# Altium project PCB_ROS_CONTROLLER.PrjPcb
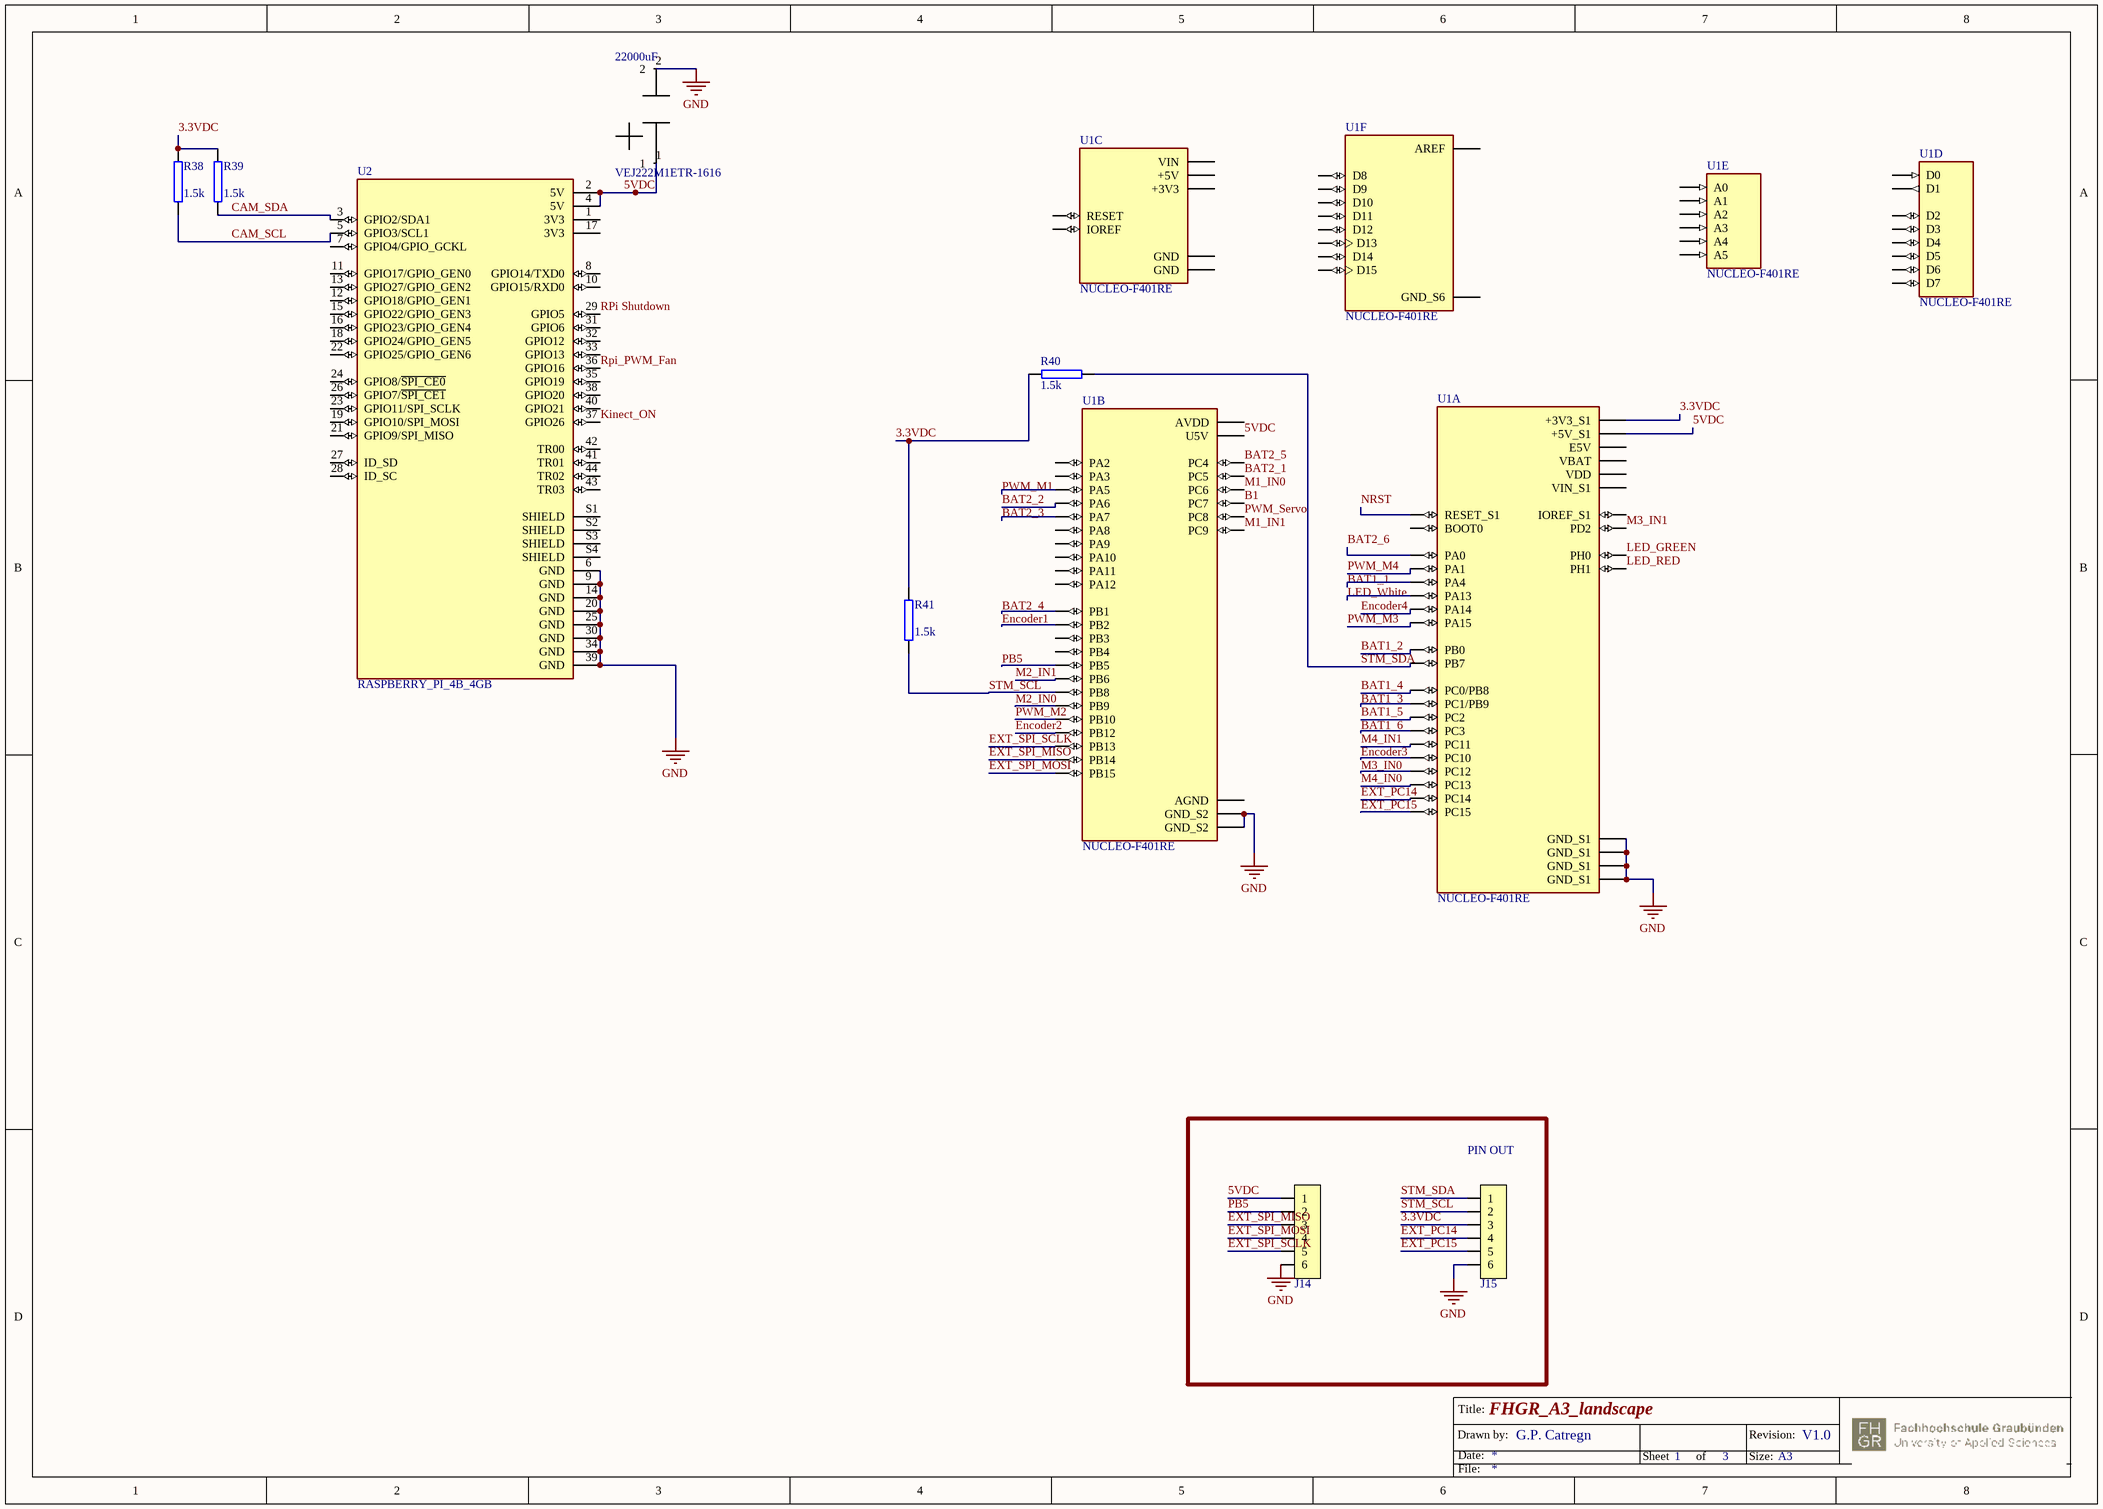
[diagram p0: controllers.SchDoc]
3 sheets, 109 parts. Net scope: global (net labels, ports and power ports of the same name join across sheets).
Board file: PCB2.PcbDoc
Sheets:
  controllers.SchDoc
  INPUT_OUTPUT.SchDoc
  BAT.SchDoc

## Sheet controllers.SchDoc: FHGR_A3_landscape
size A3; Date: 18.07.2017; DrawnBy: G.P. Catregn; Organization: HTW Chur; Address1: Pulvermühlestrasse 57; Address2: 7004 Chur; Address3: Switzerland; DocumentNumber: 1; Revision: V1.0; SheetNumber: 1; SheetTotal: 3; DocumentName: HTW Template

### Parts
22000uF  VEJ222M1ETR-1616  [CAPAE180170X170M]
J14  6Pin_Male  [Header1x6_254]  (value not drawn)
J15  6Pin_Male  [Header1x6_254]  (value not drawn)
R38  value 1.5k  [0805]  (hidden comment: R 1K5 0805)
R39  value 1.5k  [0805]  (hidden comment: R 1K5 0805)
R40  value 1.5k  [0805]  (hidden comment: R 1K5 0805)
R41  value 1.5k  [0805]  (hidden comment: R 1K5 0805)
U1  NUCLEO-F401RE  [ST_NUCLEO-F401RE]  (parts A,B,C,D,E,F of 6)
U2  RASPBERRY_PI_4B_4GB  [MODULE_RASPBERRY_PI_4B_4GB]

### Blocks framed on the sheet
PIN OUT: J14 J15

### Nets
GND: 22000uF.2 J14.6 J15.6 U1.CN7_8(GND_S1) U1.CN7_19(GND_S1) U1.CN7_20(GND_S1) U1.CN7_22(GND_S1) U1.CN10_9(GND_S2) U1.CN10_20(GND_S2) U2.6(GND) U2.9(GND) U2.14(GND) U2.20(GND) U2.25(GND) U2.30(GND) U2.34(GND) U2.39(GND)
3.3VDC: J15.3 R38.2 R39.2 R40.2 R41.2 U1.CN7_16(+3V3_S1)
5VDC: 22000uF.1 J14.1 U1.CN7_18(+5V_S1) U1.CN10_8(U5V) U2.2(5V) U2.4(5V)
B1: U1.CN10_19(PC7)
BAT1_1: U1.CN7_32(PA4)
BAT1_2: U1.CN7_34(PB0)
BAT1_3: U1.CN7_36(PC1/PB9)
BAT1_4: U1.CN7_38(PC0/PB8)
BAT1_5: U1.CN7_35(PC2)
BAT1_6: U1.CN7_37(PC3)
BAT2_1: U1.CN10_6(PC5)
BAT2_2: U1.CN10_13(PA6)
BAT2_3: U1.CN10_15(PA7)
BAT2_4: U1.CN10_24(PB1)
BAT2_5: U1.CN10_34(PC4)
BAT2_6: U1.CN7_28(PA0)
CAM_SCL: R38.1 U2.5(GPIO3/SCL1)
CAM_SDA: R39.1 U2.3(GPIO2/SDA1)
Encoder1: U1.CN10_22(PB2)
Encoder2: U1.CN10_16(PB12)
Encoder3: U1.CN7_1(PC10)
Encoder4: U1.CN7_15(PA14)
EXT_PC14: J15.4 U1.CN7_25(PC14)
EXT_PC15: J15.5 U1.CN7_27(PC15)
EXT_SPI_MISO: J14.3 U1.CN10_28(PB14)
EXT_SPI_MOSI: J14.4 U1.CN10_26(PB15)
EXT_SPI_SCLK: J14.5 U1.CN10_30(PB13)
Kinect_ON: U2.37(GPIO26)
LED_GREEN: U1.CN7_29(PH0)
LED_RED: U1.CN7_31(PH1)
LED_White: U1.CN7_13(PA13)
M1_IN0: U1.CN10_4(PC6)
M1_IN1: U1.CN10_1(PC9)
M2_IN0: U1.CN10_5(PB9)
M2_IN1: U1.CN10_17(PB6)
M3_IN0: U1.CN7_3(PC12)
M3_IN1: U1.CN7_4(PD2)
M4_IN0: U1.CN7_23(PC13)
M4_IN1: U1.CN7_2(PC11)
NRST: U1.CN7_14(RESET_S1)
PB5: J14.2 U1.CN10_29(PB5)
PWM_M1: U1.CN10_11(PA5)
PWM_M2: U1.CN10_25(PB10)
PWM_M3: U1.CN7_17(PA15)
PWM_M4: U1.CN7_30(PA1)
PWM_Servo: U1.CN10_2(PC8)
RPi Shutdown: U2.29(GPIO5)
Rpi_PWM_Fan: U2.36(GPIO16)
STM_SCL: J15.2 R41.1 U1.CN10_3(PB8)
STM_SDA: J15.1 R40.1 U1.CN7_21(PB7)

Not connected (* = marked no-connect by the designer): U1 CN5_1(D8) CN5_2(D9) CN5_3(D10) CN5_4(D11) CN5_5(D12) CN5_6(D13) CN5_7(GND_S6) CN5_8(AREF) CN5_9(D14) CN5_10(D15) CN6_2(IOREF) CN6_3(RESET) CN6_4(+3V3) CN6_5(+5V) CN6_6(GND) CN6_7(GND) CN6_8(VIN) CN7_5(VDD) CN7_6(E5V) CN7_7(BOOT0) CN7_12(IOREF_S1) CN7_24(VIN_S1) CN7_33(VBAT) CN8_1(A0) CN8_2(A1) CN8_3(A2) CN8_4(A3) CN8_5(A4) CN8_6(A5) CN9_1(D0) CN9_2(D1) CN9_3(D2) CN9_4(D3) CN9_5(D4) CN9_6(D5) CN9_7(D6) CN9_8(D7) CN10_7(AVDD) CN10_12(PA12) CN10_14(PA11) CN10_21(PA9) CN10_23(PA8) CN10_27(PB4) CN10_31(PB3) CN10_32(AGND) CN10_33(PA10) CN10_35(PA2) CN10_37(PA3); U2 1(3V3) 7(GPIO4/GPIO_GCKL) 8(GPIO14/TXD0) 10(GPIO15/RXD0) 11(GPIO17/GPIO_GEN0) 12(GPIO18/GPIO_GEN1) 13(GPIO27/GPIO_GEN2) 15(GPIO22/GPIO_GEN3) 16(GPIO23/GPIO_GEN4) 17(3V3) 18(GPIO24/GPIO_GEN5) 19(GPIO10/SPI_MOSI) 21(GPIO9/SPI_MISO) 22(GPIO25/GPIO_GEN6) 23(GPIO11/SPI_SCLK) 24(GPIO8/~{SPI_CE0}) 26(GPIO7/~{SPI_CE1}) 27(ID_SD) 28(ID_SC) 31(GPIO6) 32(GPIO12) 33(GPIO13) 35(GPIO19) 38(GPIO20) 40(GPIO21) 41(TR01) 42(TR00) 43(TR03) 44(TR02) S1(SHIELD) S2(SHIELD) S3(SHIELD) S4(SHIELD)

### Notes on the sheet
- Drawn by:
- Title:
- Date:
- Sheet
- of
- Size:
- Revision:
- A3
- File:

### Library data of the parts
J14 J15 = ArduinoConnector_6: Part ID: ArduinoConnector_6; Price 1pc (CHF): 0.32; Supplier 1: Digi-Key; ComponentLink1Description: Datasheet; ComponentLink1URL: https://katalog.we-online.de/em/datasheet/6130xx11121.pdf; Supplier Part Number 1: 732-5319-ND
R38-R41 = R_1k5_0805: Tolerance: 1%; Power Dissipation: 250mW; Part ID: R_1k5_0805; Price 10pcs (CHF): 0.072; Supplier 1: Digi-Key; Supplier Part Number 1: RNCP0805FTD1K50CT-ND
U1 = NUCLEO-F401RE: STM32 Nucleo-64 development board with STM32F401RET6 MCU, supports Arduino and ST morpho connectivity; Value: *; MP: NUCLEO-F401RE; Package: None; Availability: Unavailable; Price: None
U2 = CMP-052-000000-1: BCM2711 Raspberry Pi 4 Model B 4GB - ARMÂ® CortexÂ®-A72 MPU Embedded Evaluation Board; MP: RASPBERRY PI 4B/4GB; Design Item ID: RASPBERRY_PI_4B_4GB; Source: RASPBERRY_PI_4B_4GB.SchLib; MF: Raspberry Pi; Check_prices: https://www.snapeda.com/parts/RASPBERRY%20PI%204B/4GB/Raspberry+Pi/view-part/?ref=eda; SnapEDA_Link: https://www.snapeda.com/parts/RASPBERRY%20PI%204B/4GB/Raspberry+Pi/view-part/?ref=snap; Value: *; Purchase-URL: https://pricing.snapeda.com/search/part/RASPBERRY PI 4B/4GB/?ref=eda; Price: None; Availability: In Stock; Package: None; Component Type: Standard; Pin Count: 48

## Sheet INPUT_OUTPUT.SchDoc: FHGR_A3_landscape
size A3; Date: 18.07.2017; DrawnBy: G.P. Catregn; Organization: HTW Chur; Address1: Pulvermühlestrasse 57; Address2: 7004 Chur; Address3: Switzerland; DocumentNumber: 1; Revision: V1.0; SheetNumber: 2; SheetTotal: 3; DocumentName: HTW Template
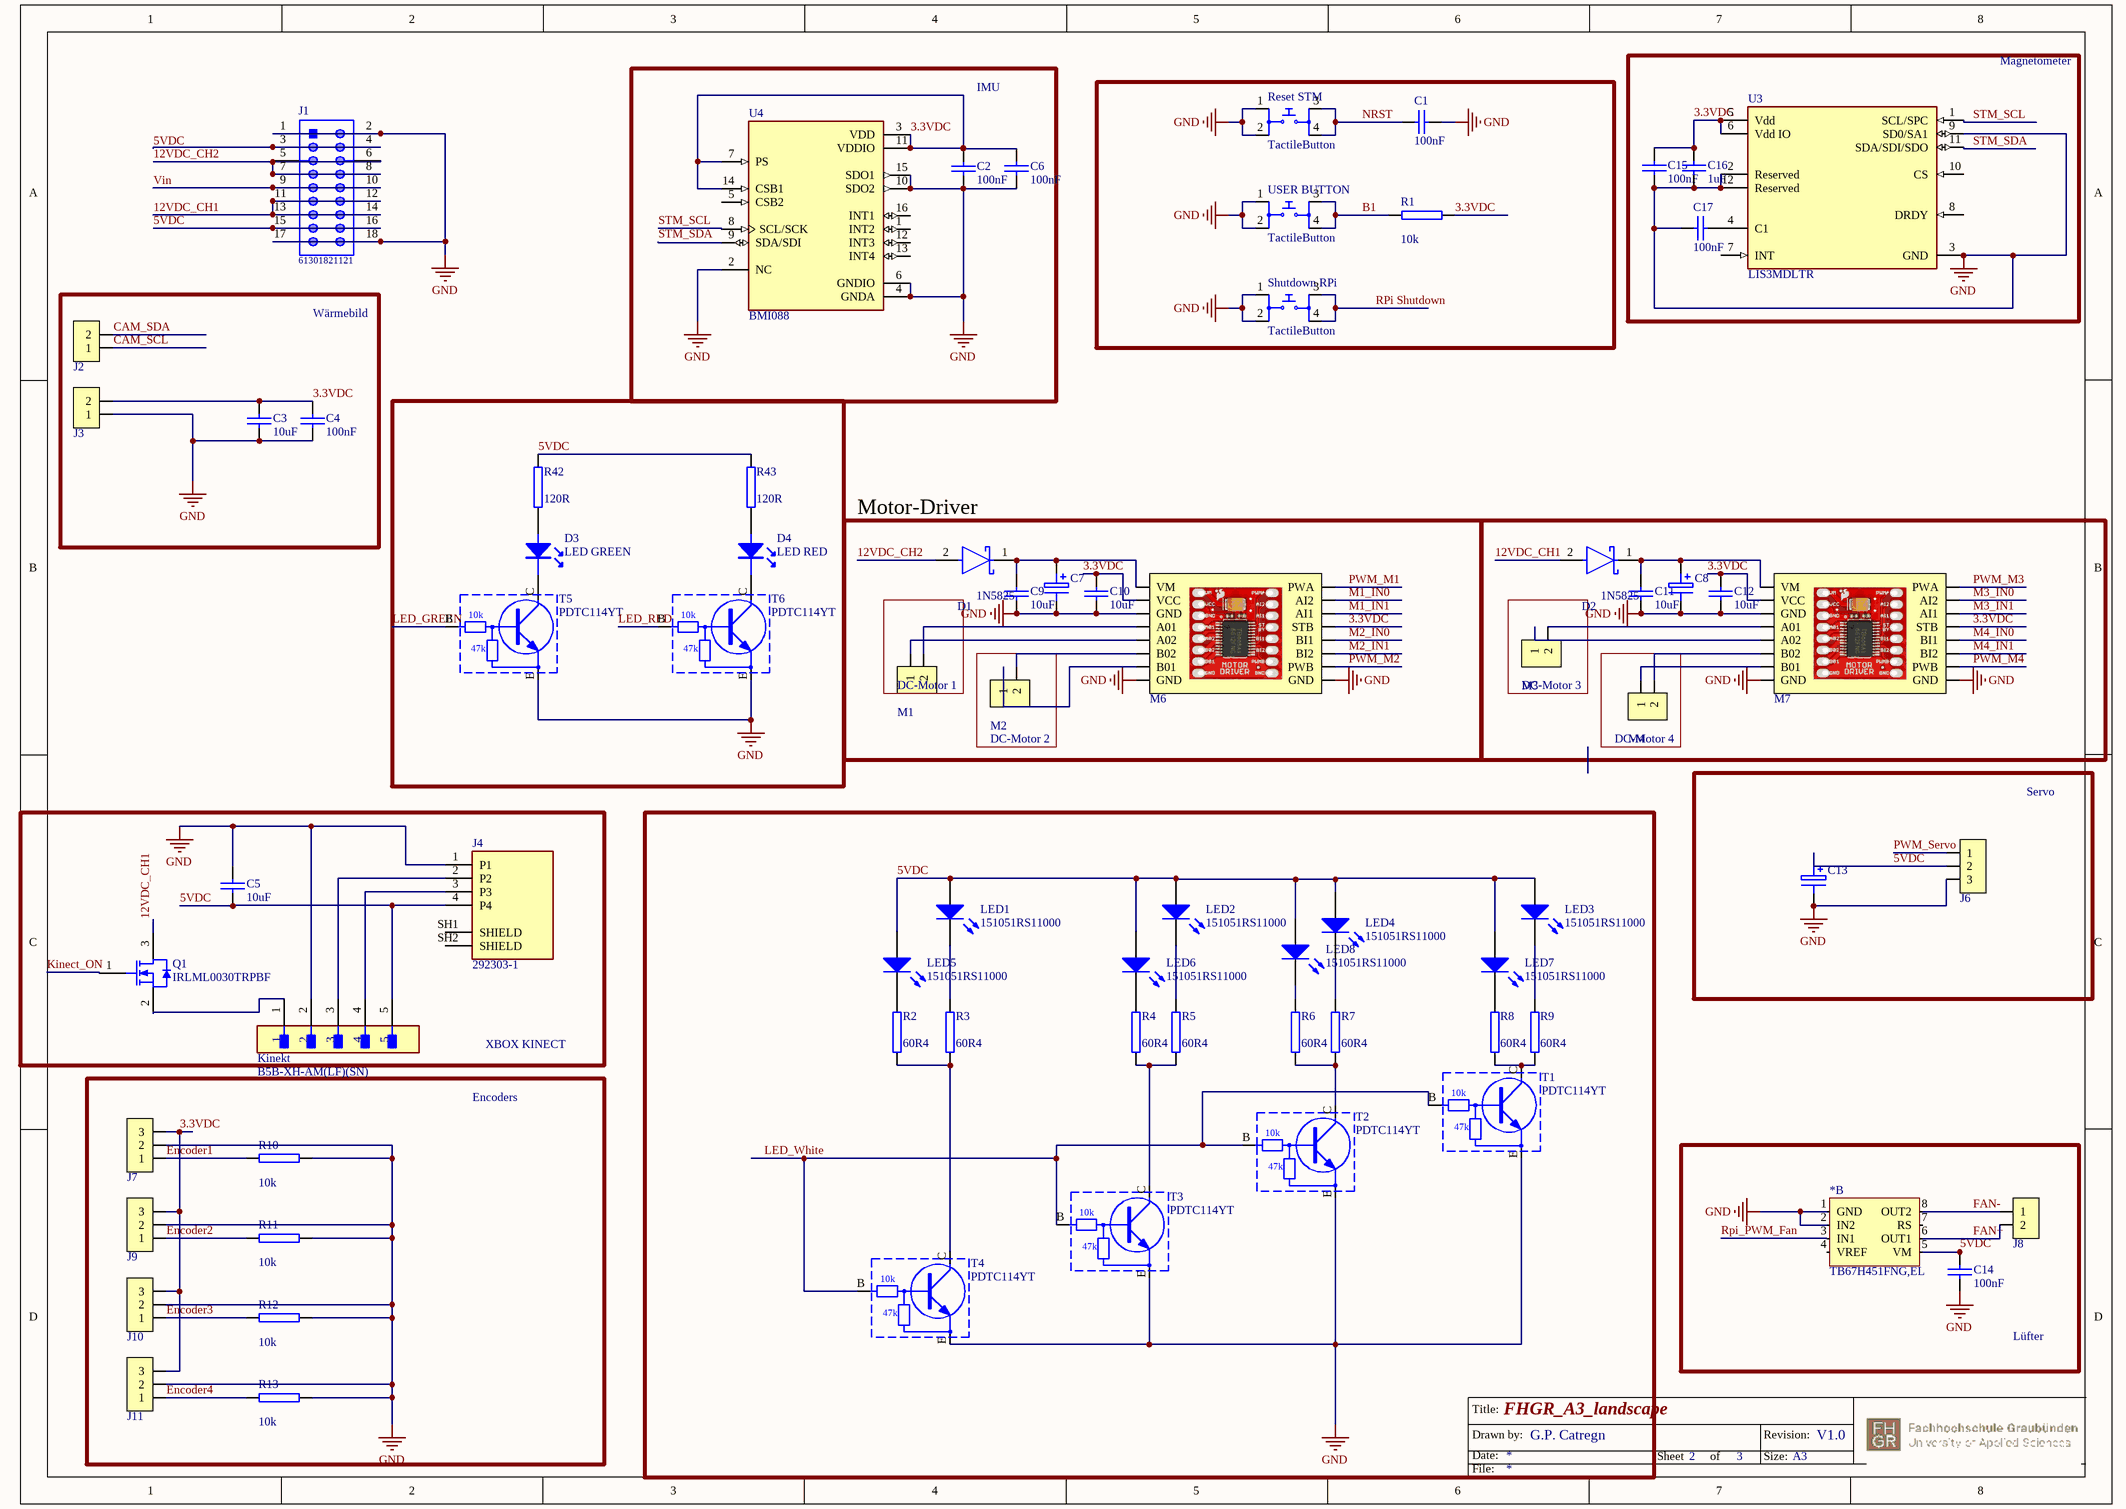
[diagram p1: INPUT_OUTPUT.SchDoc]

### Parts
*  TB67H451FNG,EL  [SOIC127P600X170_HS-9N]  (part B of 2)
C1  value 100nF  [0603]  (hidden comment: C 100nF 0603)
C2  value 100nF  [0603]  (hidden comment: C 100nF 0603)
C3  value 10uF  [0603]  (hidden comment: C 10uF 0603)
C4  value 100nF  [0603]  (hidden comment: C 100nF 0603)
C5  value 10uF  [0603]  (hidden comment: C 10uF 0603)
C6  value 100nF  [0603]  (hidden comment: C 100nF 0603)
C7  C 100uF ALUM  [PCAP_8x10-ELEC00]  (value not drawn)
C8  C 100uF ALUM  [PCAP_8x10-ELEC00]  (value not drawn)
C9  value 10uF  [0603]  (hidden comment: C 10uF 0603)
C10  value 10uF  [0603]  (hidden comment: C 10uF 0603)
C11  value 10uF  [0603]  (hidden comment: C 10uF 0603)
C12  value 10uF  [0603]  (hidden comment: C 10uF 0603)
C13  C 100uF ALUM  [PCAP_8x10-ELEC00]  (value not drawn)
C14  value 100nF  [0603]  (hidden comment: C 100nF 0603)
C15  value 100nF  [0603]  (hidden comment: C 100nF 0603)
C16  value 1uF  [0603]  (hidden comment: C 1uF 0603)
C17  value 100nF  [0603]  (hidden comment: C 100nF 0603)
D1  1N5825  [Microsemi_1N5825_0]  (value not drawn)
D2  1N5825  [Microsemi_1N5825_0]  (value not drawn)
D3  LED GREEN  [LED_1206]
D4  LED RED  [LED_1206]
J1  61301821121  [61301821121]
J2  2Pin_Male  [Header1x2_254]  (value not drawn)
J3  2Pin_Male  [Header1x2_254]  (value not drawn)
J4  292303-1  [TE_292303-1]
J6  3Pin_Male  [Header1x3_254]  (value not drawn)
J7  3Pin_Male  [Header1x3_254]  (value not drawn)
J8  2Pin_Male  [Header1x2_254]  (value not drawn)
J9  3Pin_Male  [Header1x3_254]  (value not drawn)
J10  3Pin_Male  [Header1x3_254]  (value not drawn)
J11  3Pin_Male  [Header1x3_254]  (value not drawn)
Kinekt  B5B-XH-AM(LF)(SN)  [FP-B5B-XH-AM_LF_SN-MFG]
LED1  151051RS11000  [Type 5mm]
LED2  151051RS11000  [Type 5mm]
LED3  151051RS11000  [Type 5mm]
LED4  151051RS11000  [Type 5mm]
LED5  151051RS11000  [Type 5mm]
LED6  151051RS11000  [Type 5mm]
LED7  151051RS11000  [Type 5mm]
LED8  151051RS11000  [Type 5mm]
M1  2Pin_Female  [OSTTE020104]  (value not drawn)
M2  2Pin_Female  [OSTTE020104]  (value not drawn)
M3  2Pin_Female  [OSTTE020104]  (value not drawn)
M4  2Pin_Female  [OSTTE020104]  (value not drawn)
M6  SPARKFUN_ROB_14451  [SPARKFUN_ROB_14451]  (value not drawn)
M7  SPARKFUN_ROB_14451  [SPARKFUN_ROB_14451]  (value not drawn)
Q1  IRLML0030TRPBF  [INTR-SOT-23-3_V]
R1  value 10k  [0805]  (hidden comment: R 10K 0805)
R2  value 60R4  [0805]  (hidden comment: R 60R4 0805)
R3  value 60R4  [0805]  (hidden comment: R 60R4 0805)
R4  value 60R4  [0805]  (hidden comment: R 60R4 0805)
R5  value 60R4  [0805]  (hidden comment: R 60R4 0805)
R6  value 60R4  [0805]  (hidden comment: R 60R4 0805)
R7  value 60R4  [0805]  (hidden comment: R 60R4 0805)
R8  value 60R4  [0805]  (hidden comment: R 60R4 0805)
R9  value 60R4  [0805]  (hidden comment: R 60R4 0805)
R10  value 10k  [0805]  (hidden comment: R 10K 0805)
R11  value 10k  [0805]  (hidden comment: R 10K 0805)
R12  value 10k  [0805]  (hidden comment: R 10K 0805)
R13  value 10k  [0805]  (hidden comment: R 10K 0805)
R42  value 120R  [0805]  (hidden comment: R 120R 0805)
R43  value 120R  [0805]  (hidden comment: R 120R 0805)
Reset_STM  TactileButton  [TactileButton-6x6mm]
Shutdown_RPi  TactileButton  [TactileButton-6x6mm]
T1  PDTC114YT  [SOT-23]
T2  PDTC114YT  [SOT-23]
T3  PDTC114YT  [SOT-23]
T4  PDTC114YT  [SOT-23]
T5  PDTC114YT  [SOT-23]
T6  PDTC114YT  [SOT-23]
U3  LIS3MDLTR  [FP-VFLGA-12-8365767-MFG]
U4  BMI088  [PQFN50P450X300X100-16N]
USER_BUTTON  TactileButton  [TactileButton-6x6mm]

### Blocks framed on the sheet
IMU: C2 C6 U4
Magnetometer: C15-C17 U3
Wärmebild: C3 C4 J2 J3
Motor-Driver: C7 C9 C10 D1 M6
DC-Motor 1: M1
DC-Motor 3: M3
DC-Motor 2: M2
DC-Motor 4: M4
Servo: C13 J6
XBOX KINECT: C5 J4 Kinekt Q1
Encoders: J7 J9-J11 R10-R13
Lüfter: * C14 J8

### Nets
GND: *.1(GND) *.2(IN2) C1.2 C2.2 C3.2 C4.2 C5.1 C6.2 C7.2 C8.2 C9.2 C10.2 C11.2 C12.2 C13.2 C14.2 C15.2 C16.2 C17.1 J1.1 J1.2 J1.17 J1.18 J3.1 J4.1(P1) J6.3 J7.2 J9.2 J10.2 J11.2 Kinekt.2 M6.3(GND) M6.8(GND) M6.9(GND) M7.3(GND) M7.8(GND) M7.9(GND) R10.2 R11.2 R12.1 R13.2 Reset_STM.1 Reset_STM.2 Shutdown_RPi.1 Shutdown_RPi.2 T1.E T2.E T3.E T4.E T5.E T6.E U3.2(Reserved) U3.3(GND) U3.9(SD0/SA1) U3.12(Reserved) U4.2(NC) U4.4(GNDA) U4.6(GNDIO) U4.10(SDO2) U4.15(SDO1) USER_BUTTON.1 USER_BUTTON.2
3.3VDC: C2.1 C3.1 C4.1 C6.1 C10.1 C12.1 C15.1 C16.1 J3.2 J7.3 J9.3 J10.3 J11.3 M6.2(VCC) M6.13(STB) M7.2(VCC) M7.13(STB) R1.2 U3.5(Vdd) U3.6(Vdd_IO) U4.3(VDD) U4.7(PS) U4.11(VDDIO) U4.14(CSB1)
5VDC: *.5(VM) C5.2 C13.1 C14.1 J1.3 J1.4 J1.15 J1.16 J4.4(P4) J6.2 Kinekt.5 LED1.2(A) LED2.2(A) LED3.2(A) LED4.2(A) LED5.2(A) LED6.2(A) LED7.2(A) LED8.2(A) R42.2 R43.2
12VDC_CH1: D2.2(A) J1.11 J1.12 J1.13 J1.14 Q1.3(D)
12VDC_CH2: D1.2(A) J1.5 J1.6 J1.7 J1.8
B1: R1.1 USER_BUTTON.3 USER_BUTTON.4
CAM_SCL: J2.1
CAM_SDA: J2.2
Encoder1: J7.1 R10.1
Encoder2: J9.1 R11.1
Encoder3: J10.1 R12.2
Encoder4: J11.1 R13.1
FAN+: *.6(OUT1) J8.2
FAN-: *.8(OUT2) J8.1
Kinect_ON: Q1.1(G)
LED_GREEN: T5.B
LED_RED: T6.B
LED_White: T1.B T2.B T3.B T4.B
M1_IN0: M6.15(AI2)
M1_IN1: M6.14(AI1)
M2_IN0: M6.12(BI1)
M2_IN1: M6.11(BI2)
M3_IN0: M7.15(AI2)
M3_IN1: M7.14(AI1)
M4_IN0: M7.12(BI1)
M4_IN1: M7.11(BI2)
NRST: C1.1 Reset_STM.3 Reset_STM.4
PWM_M1: M6.16(PWA)
PWM_M2: M6.10(PWB)
PWM_M3: M7.16(PWA)
PWM_M4: M7.10(PWB)
PWM_Servo: J6.1
RPi Shutdown: Shutdown_RPi.3 Shutdown_RPi.4
Rpi_PWM_Fan: *.3(IN1)
STM_SCL: U3.1(SCL/SPC) U4.8(SCL/SCK)
STM_SDA: U3.11(SDA/SDI/SDO) U4.9(SDA/SDI)
Vin: J1.9 J1.10
NetC7_1: C7.1 C9.1 D1.1(C) M6.1(VM)
NetC8_1: C8.1 C11.1 D2.1(C) M7.1(VM)
NetC17_2: C17.2 U3.4(C1)
NetD3_A: D3.A R42.1
NetD3_K: D3.K T5.C
NetD4_A: D4.A R43.1
NetD4_K: D4.K T6.C
NetJ4_2: J4.2(P2) Kinekt.3
NetJ4_3: J4.3(P3) Kinekt.4
NetKinekt_1: Kinekt.1 Q1.2(S)
NetLED1_1: LED1.1(K) R3.2
NetLED2_1: LED2.1(K) R5.2
NetLED3_1: LED3.1(K) R9.2
NetLED4_1: LED4.1(K) R7.2
NetLED5_1: LED5.1(K) R2.2
NetLED6_1: LED6.1(K) R4.2
NetLED7_1: LED7.1(K) R8.2
NetLED8_1: LED8.1(K) R6.2
NetM1_1: M1.1 M6.5(A02)
NetM1_2: M1.2 M6.4(A01)
NetM2_1: M2.1 M6.7(B01)
NetM2_2: M2.2 M6.6(B02)
NetM3_1: M3.1 M7.5(A02)
NetM3_2: M3.2 M7.4(A01)
NetM4_1: M4.1 M7.7(B01)
NetM4_2: M4.2 M7.6(B02)
NetR2_1: R2.1 R3.1 T4.C
NetR4_1: R4.1 R5.1 T3.C
NetR6_1: R6.1 R7.1 T2.C
NetR8_1: R8.1 R9.1 T1.C

Not connected (* = marked no-connect by the designer): * 4(VREF) 7(RS); J4 SH1(SHIELD) SH2(SHIELD); U3 7(INT) 8(DRDY) 10(CS); U4 1(INT2) 5(CSB2) 12(INT3) 13(INT4) 16(INT1)

### Notes on the sheet
- Drawn by:
- Title:
- Date:
- Sheet
- of
- Size:
- Revision:
- A3
- File:
- (in symbol T_PDTC114YT) 10k; 47k

### Library data of the parts
C1 C2 C4 C6 C14 C15 C17 = C_100nF_0603: TempKoeff: Y5V; Tolerance: -20%/+80%; Voltage: 50V; Part ID: C_100nF_0603; Price 1pc (CHF): 0.1; Supplier 1: Digi-Key; Supplier Part Number 1: 1276-1012-1-ND
C3 C5 C9-C12 = C_10uF_0603: TempKoeff: X5R; Tolerance: 10%; Voltage: 16V; Part ID: C_10uF_0603; Price 1pc (CHF): 0.40; Supplier 1: Digi-Key; Supplier Part Number 1: 490-12317-1-ND
C7 C8 C13 = C_100uF_ALUM: Tolerance: 20%; Voltage: 50V; VALUE: 100uF; Part ID: C_100uF_ALUM; Price 1pc (CHF): 0.51; Supplier 1: Digi-Key; Supplier Part Number 1: 493-2226-1-ND
C16 = C_1uF_0603: TempKoeff: X7R; Tolerance: 10%; Voltage: 25V; Part ID: C_1uF_0603; Price 1pc (CHF): 0.29; Supplier 1: Digi-Key; Supplier Part Number 1: 1276-6617-1-ND
D3 = LED_GREEN_1206: Peak Wavelenght: 565nm; Part ID: LED_GREEN_1206; Price 10pcs: 0.226; Supplier 1: Digi-Key; Supplier Part Number 1: 67-1357-1-ND; ComponentLink1Description: Datasheet; ComponentLink1URL: https://media.digikey.com/pdf/Data%20Sheets/Lite-On%20PDFs/LTST-C230KGKT.pdf
D4 = LED_RED_1206: Peak Wavelenght: 639nm; Part ID: LED_RED_1206; Price 10pcs: 0.233; Supplier 1: Digi-Key; Supplier Part Number 1: 160-1457-1-ND; ComponentLink1Description: Datasheet; ComponentLink1URL: https://media.digikey.com/pdf/Data%20Sheets/Lite-On%20PDFs/LTST-C230KRKT.pdf
J1 = CMP-1502-01101-1: THT Vertical Pin Header WR-PHD, Pitch 2.54 mm, Dual Row, 18 pins; Manufacturer: Wurth Elektronik; Withstanding Voltage: 500VAC; Pin Number: 18; Pitch: 2.54mm; Rated Current: 3A; Contact Resistance: 20mOhm; Gender: Male; Working Voltage: 250VAC; Publisher: WurthElektronik; Packaging: Bag; Row Number: Dual; Datasheet URL: https://katalog.we-online.de/em/datasheet/6130xx21121.pdf; Mounting Technology: THT; Orientation: Vertical; Part Number: 61301821121; Package Reference: 61301821121; Manufacturer URL: http://www.we-online.de; Operating Temperature: -40to105degC
J2 J3 J8 = Header_2: Part ID: Header_2; Price 1pc (CHF): 0.13; Supplier 1: Digi-Key; ComponentLink1Description: Datasheet; ComponentLink1URL: https://katalog.we-online.de/em/datasheet/6130xx11121.pdf; Supplier Part Number 1: 732-5315-ND
J4 = 292303-1: CONN USB RECEPT R/A TYPE A 4POS; Value: *; MP: 292303-1; Package: None; Availability: Unavailable; Price: None
J6 J7 J9-J11 = Header_3: Part ID: Header_3; Price 1pc (CHF): 0.12; Supplier 1: Digi-Key; ComponentLink1Description: Datasheet; ComponentLink1URL: https://www.we-online.com/katalog/datasheet/6130xx11121.pdf; Supplier Part Number 1: 732-5316-ND
Kinekt = CMP-17439-000304-1: CONN HEADER VERT 5POS 2.5MM; Mated Stacking Heights: 9.8mm; Voltage Rating: 250V; Max Current Rating: 3A; Number of Positions: 5; Contact Resistance: 20mR; Depth: 5.75mm; Connector Type: Header; Color: Green; Insulation Material: Nylon; Contact Plating: Copper; Length: 14.9mm; Fastening Type: Detent; Contact Material: Brass; Number of Rows: 1; Contact Type: Male Pin; Housing Material: Polyamide; Housing Color: White; Lead Free: Lead Free; Max Voltage Rating (AC): 250V; Mount: Through Hole; Contact Shape: Square; Min Operating Temperature: -25°C; Packaging: Bulk; Orientation: Straight; Insulation Color: Natural; Series: XH; Flammability Rating: UL94 V-0; Contact Finish - Mating: TIN; Max Operating Temperature: 85°C; Termination: Solder; Pitch: 2.5mm
LED1-LED8 = CMP-1488-00008-1: THT LED round mono-color color lens, WL-TMRW, Red; Manufacturer: Wuerth Elektronik; PackageReference: Type 5mm; PartNumber: 151051RS11000; ComponentLink2URL: http://katalog.we-online.de/pbs/datasheet/7448042001.pdfhttp://katalog.we-online.de/pbs/datasheet/7448042001.pdfhttp://katalog.we-online.de/pbs/datasheet/7448042001.pdfhttp://katalog.we-online.de/pbs/datasheet/151051RS11000.pdf; ComponentLink1URL: http://www.we-online.com; ComponentLink1Description: Manufacturer URL; ComponentLink2Description: Datasheet; Emitting color: Red
M1-M4 = Terminal_2Pin: Part ID: Terminal_2Pin; Price 1pc (CHF): 0.69; Supplier 1: Digi-Key; ComponentLink1Description: Datasheet; ComponentLink1URL: https://www.on-shore.com/wp-content/uploads/OSTTEXX0104.pdf; Supplier Part Number 1: ED2740-ND
M6 M7 = SPARKFUN_ROB_14451: Dual Motor Driver; Stecker: 2 x 732-5321-ND; Buchse: 2 x SAM1213-08-ND; Part ID: SPARKFUN_ROB_14451; Price 1pc (CHF): 4.5; Supplier 1: Digi-Key; ComponentLink1Description: Datasheet; ComponentLink1URL: https://media.digikey.com/pdf/Data%20Sheets/Sparkfun%20PDFs/ROB-14451_Web.pdf; Supplier Part Number 1: 1568-1756-ND
Q1 = CMP-2000-06483-1: HEXFET(R) Power MOSFET, 1.3 W, 4.4 ns, -55 to 150 degC, 3-Pin SOT-23, RoHS, Tape and Reel; Manufacturer: International Rectifier; Maximum Drain Source Resistance: 0.027Ω; Transistor Configuration: Single; Channel Mode: Enhancement; Maximum Power Dissipation: 1.3W; Typical Input Capacitance @ Vds: 382pF@15V; Maximum Gate Source Voltage: ±20V; Number of Elements per Chip: 1; Transistor Material: Si; Maximum Gate Threshold Voltage: 2.3V; Typical Turn-On Delay Time: 5.2ns; Maximum Drain Source Voltage: 30V; Typical Turn-Off Delay Time: 7.4ns; Minimum Gate Threshold Voltage: 1.3V; Channel Type: N; Typical Gate Charge @ Vgs: 2.6nC@4.5V; Maximum Continuous Drain Current: 5.3A; Pin Count: 3; Mounting Technology: SurfaceMount; Datasheet URL: https://datasheet.ciiva.com/4442/irlml0030pbf-90019-4442451.pdf; Datasheet Version: 02/2012; Maximum Operating Temperature: +150°C; Category: PowerMOSFET; Package Description: 3-Pin Small Outline Transistor, Body 2.92 x 1.3 mm, Pitch 0.95 mm; Manufacturer URL: http://internationalrectifier.com/; Height: 1.02mm; Minimum Operating Temperature: -55°C; Dimensions: 3.04x1.4x1.02mm; Package Reference: SOT-23-3; Package Type: SOT-23; Mounting Type: SurfaceMount; Length: 3.04mm; Width: 1.4mm
R1 R10-R13 = R_10k_0805: Tolerance: 1%; Power Dissipation: 125mW; Part ID: R_10k_0805; Price 10pcs (CHF): 0.021; Supplier 1: Digi-Key; Supplier Part Number 1: 311-10.0KCRCT-ND
R2-R9 = R_60R4_0805: Tolerance: 1%; Power Dissipation: 125mW; Part ID: R_60R4_0805; Price 10pcs (CHF): 0.042; Supplier 1: Digi-Key; Supplier Part Number 1: 311-60.4CRCT-ND
R42 R43 = R_120R_0805: Tolerance: 1%; Power Dissipation: 125mW; Part ID: R_120R_0805; Price 10pcs (CHF): 0.046; Supplier 1: Digi-Key; Supplier Part Number 1: A129738CT-ND
Reset_STM Shutdown_RPi USER_BUTTON = TactileButton: Voltage: 12V; Current: 50mA; Part ID: TactileButton; Price 1pc (CHF): 0.59; Dimension: 6.2mmx6.2mmx4.3mm; Supplier 1: Digi-Key; ComponentLink1Description: Datasheet; ComponentLink1URL: https://media.digikey.com/pdf/Data%20Sheets/APEM%20Components%20PDFs/ADTS6,%20ADTSM,%20AKTSC6%20Series.pdf; Supplier Part Number 1: 679-2380-1-ND
T1-T6 = T_PDTC114YT: Frequency: 230MHz; Voltage: 50V; Current: 100mA; Power Dissipation: 250mW; Part ID: T_PDTC114YT; Price 1pc (CHF): 0.18; ComponentLink1URL: https://assets.nexperia.com/documents/data-sheet/PDTC114Y_SER.pdf; ComponentLink1Description: Datasheet; Supplier 1: Digi-Key; Supplier Part Number 1: 1727-5134-6-ND
U3 = CMP-2000-07463-2: SENSOR MR I2C/SPI 12LGA; Manufacturer: STMicroelectronics; Sensor Output: I2C,SPI; Operating Supply Current: 40-270uA; Max Supply Voltage: 3.6V; Sensing Method: Magnetic; Min Supply Voltage: 1.71V; ComponentLink2URL: https://www.st.com/resource/en/datasheet/lis3mdl.pdf; Category: IC; Manufacturer Part Number: LIS3MDLTR; Octopart: https://octopart.com/lis3mdltr-stmicroelectronics-29403125; Automotive: No; ComponentLink2Description: Datasheet; RoHS: TRUE; Device Class L3: unset; Device Class L1: Sensors; Temperature: -40°C to +85°C; Height: 1mm; Mouser Description: Board Mount Hall Effect / Magnetic Sensors Ultra Lo-Pwr Hi Perf 3-Axis 1.9-3.6V; Temperature Range High: +85°C; Lead Free: Yes; Device Class L2: Magnetic Sensors; Footprint Url: https://www.st.com/content/ccc/resource/technical/document/technical_note/73/17/9c/16/dd/96/4a/01/CD00134799.pdf/files/CD00134799.pdf/jcr:content/translations/en.CD00134799.pdf; Temperature Range Low: -40°C; Package: VFLGA-12-8365767; Digikey Description: SENSOR MR I2C/SPI 12LGA
U4 = BMI088: High-performance 6-axis inertial sensor (accelerometer + gyroscope) <a href="https://pricing.snapeda.com/parts/BMI088/Bosch%20Sensortec/view-part?ref=eda">Check prices</a>; Package: None; MP: BMI088; Value: *; Availability: Unavailable; Price: None

## Sheet BAT.SchDoc: FHGR_A3_landscape
size A3; Date: 18.07.2017; DrawnBy: G.P. Catregn; Organization: HTW Chur; Address1: Pulvermühlestrasse 57; Address2: 7004 Chur; Address3: Switzerland; DocumentNumber: 1; Revision: V1.0; SheetNumber: 3; SheetTotal: 3; DocumentName: HTW Template
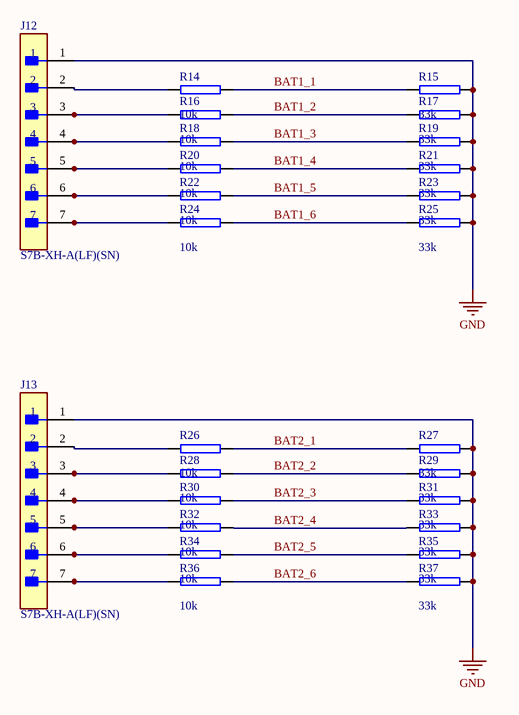
[diagram p2: BAT.SchDoc]

### Parts
J12  S7B-XH-A(LF)(SN)  [FP-S7B-XH-A_LF_SN-MFG]
J13  S7B-XH-A(LF)(SN)  [FP-S7B-XH-A_LF_SN-MFG]
R14  value 10k  [0805]  (hidden comment: R 10K 0805)
R15  value 33k  [0805]  (hidden comment: R 33K 0805)
R16  value 10k  [0805]  (hidden comment: R 10K 0805)
R17  value 33k  [0805]  (hidden comment: R 33K 0805)
R18  value 10k  [0805]  (hidden comment: R 10K 0805)
R19  value 33k  [0805]  (hidden comment: R 33K 0805)
R20  value 10k  [0805]  (hidden comment: R 10K 0805)
R21  value 33k  [0805]  (hidden comment: R 33K 0805)
R22  value 10k  [0805]  (hidden comment: R 10K 0805)
R23  value 33k  [0805]  (hidden comment: R 33K 0805)
R24  value 10k  [0805]  (hidden comment: R 10K 0805)
R25  value 33k  [0805]  (hidden comment: R 33K 0805)
R26  value 10k  [0805]  (hidden comment: R 10K 0805)
R27  value 33k  [0805]  (hidden comment: R 33K 0805)
R28  value 10k  [0805]  (hidden comment: R 10K 0805)
R29  value 33k  [0805]  (hidden comment: R 33K 0805)
R30  value 10k  [0805]  (hidden comment: R 10K 0805)
R31  value 33k  [0805]  (hidden comment: R 33K 0805)
R32  value 10k  [0805]  (hidden comment: R 10K 0805)
R33  value 33k  [0805]  (hidden comment: R 33K 0805)
R34  value 10k  [0805]  (hidden comment: R 10K 0805)
R35  value 33k  [0805]  (hidden comment: R 33K 0805)
R36  value 10k  [0805]  (hidden comment: R 10K 0805)
R37  value 33k  [0805]  (hidden comment: R 33K 0805)

### Nets
GND: J12.1 J13.1 R15.2 R17.2 R19.2 R21.2 R23.2 R25.2 R27.2 R29.2 R31.2 R33.2 R35.2 R37.2
BAT1_1: R14.2 R15.1
BAT1_2: R16.2 R17.1
BAT1_3: R18.2 R19.1
BAT1_4: R20.2 R21.1
BAT1_5: R22.2 R23.1
BAT1_6: R24.2 R25.1
BAT2_1: R26.2 R27.1
BAT2_2: R28.2 R29.1
BAT2_3: R30.2 R31.1
BAT2_4: R32.2 R33.1
BAT2_5: R34.2 R35.1
BAT2_6: R36.2 R37.1
NetJ12_2: J12.2 R14.1
NetJ12_3: J12.3 R16.1
NetJ12_4: J12.4 R18.1
NetJ12_5: J12.5 R20.1
NetJ12_6: J12.6 R22.1
NetJ12_7: J12.7 R24.1
NetJ13_2: J13.2 R26.1
NetJ13_3: J13.3 R28.1
NetJ13_4: J13.4 R30.1
NetJ13_5: J13.5 R32.1
NetJ13_6: J13.6 R34.1
NetJ13_7: J13.7 R36.1

### Notes on the sheet
- Drawn by:
- Title:
- Date:
- Sheet
- of
- Size:
- Revision:
- A3
- File:

### Library data of the parts
J12 J13 = CMP-17439-000441-1: CONN HEADER R/A 7POS 2.5MM; Voltage Rating (AC): 250V; Contact Resistance: 10mR; Insulation Resistance: 1GR; Number of Positions: 7; Wire/Cable Gauge: 22AWG; Current Rating: 3A; Gender: Male; Flammability Rating: UL94 V-0; Packaging: Bulk; Color: Natural; Insulation Color: Natural; Lead Pitch: 2.5mm; Max Operating Temperature: 85°C; REACH SVHC: No SVHC; Contact Plating: Tin; Number of Rows: 1; Fastening Type: Detent; Voltage Rating: 250V; Pitch: 2.5mm; Contact Material: Brass; Lead Free: Lead Free; Contact Type: Male Pin; Mount: Through Hole; Min Operating Temperature: -25°C; Insulation Material: Nylon; Contact Finish - Mating: TIN; Termination: Solder; Contact Shape: Square; Connector Type: Header; Number of Contacts: 7; Orientation: Right Angle; Series: XH; Package Quantity: 250
R14 R16 R18 R20 R22 R24 R26 R28 R30 R32 R34 R36 = R_10k_0805: Tolerance: 1%; Power Dissipation: 125mW; Part ID: R_10k_0805; Price 10pcs (CHF): 0.021; Supplier 1: Digi-Key; Supplier Part Number 1: 311-10.0KCRCT-ND
R15 R17 R19 R21 R23 R25 R27 R29 R31 R33 R35 R37 = R_33k_0805: Tolerance: 1%; Power Dissipation: 125mW; Part ID: R_33k_0805; Price 10pcs (CHF): 0.042; Supplier 1: Digi-Key; Supplier Part Number 1: 311-33.0KCRCT-ND

## Nets that join several sheets
GND: controllers (17 pins), INPUT_OUTPUT (62 pins), BAT (14 pins)
3.3VDC: controllers (6 pins), INPUT_OUTPUT (24 pins)
5VDC: controllers (6 pins), INPUT_OUTPUT (21 pins)
B1: controllers (U1.CN10_19), INPUT_OUTPUT (R1.1 USER_BUTTON.3 USER_BUTTON.4)
BAT1_1: controllers (U1.CN7_32), BAT (R14.2 R15.1)
BAT1_2: controllers (U1.CN7_34), BAT (R16.2 R17.1)
BAT1_3: controllers (U1.CN7_36), BAT (R18.2 R19.1)
BAT1_4: controllers (U1.CN7_38), BAT (R20.2 R21.1)
BAT1_5: controllers (U1.CN7_35), BAT (R22.2 R23.1)
BAT1_6: controllers (U1.CN7_37), BAT (R24.2 R25.1)
BAT2_1: controllers (U1.CN10_6), BAT (R26.2 R27.1)
BAT2_2: controllers (U1.CN10_13), BAT (R28.2 R29.1)
BAT2_3: controllers (U1.CN10_15), BAT (R30.2 R31.1)
BAT2_4: controllers (U1.CN10_24), BAT (R32.2 R33.1)
BAT2_5: controllers (U1.CN10_34), BAT (R34.2 R35.1)
BAT2_6: controllers (U1.CN7_28), BAT (R36.2 R37.1)
CAM_SCL: controllers (R38.1 U2.5), INPUT_OUTPUT (J2.1)
CAM_SDA: controllers (R39.1 U2.3), INPUT_OUTPUT (J2.2)
Encoder1: controllers (U1.CN10_22), INPUT_OUTPUT (J7.1 R10.1)
Encoder2: controllers (U1.CN10_16), INPUT_OUTPUT (J9.1 R11.1)
Encoder3: controllers (U1.CN7_1), INPUT_OUTPUT (J10.1 R12.2)
Encoder4: controllers (U1.CN7_15), INPUT_OUTPUT (J11.1 R13.1)
Kinect_ON: controllers (U2.37), INPUT_OUTPUT (Q1.1)
LED_GREEN: controllers (U1.CN7_29), INPUT_OUTPUT (T5.B)
LED_RED: controllers (U1.CN7_31), INPUT_OUTPUT (T6.B)
LED_White: controllers (U1.CN7_13), INPUT_OUTPUT (T1.B T2.B T3.B T4.B)
M1_IN0: controllers (U1.CN10_4), INPUT_OUTPUT (M6.15)
M1_IN1: controllers (U1.CN10_1), INPUT_OUTPUT (M6.14)
M2_IN0: controllers (U1.CN10_5), INPUT_OUTPUT (M6.12)
M2_IN1: controllers (U1.CN10_17), INPUT_OUTPUT (M6.11)
M3_IN0: controllers (U1.CN7_3), INPUT_OUTPUT (M7.15)
M3_IN1: controllers (U1.CN7_4), INPUT_OUTPUT (M7.14)
M4_IN0: controllers (U1.CN7_23), INPUT_OUTPUT (M7.12)
M4_IN1: controllers (U1.CN7_2), INPUT_OUTPUT (M7.11)
NRST: controllers (U1.CN7_14), INPUT_OUTPUT (C1.1 Reset_STM.3 Reset_STM.4)
PWM_M1: controllers (U1.CN10_11), INPUT_OUTPUT (M6.16)
PWM_M2: controllers (U1.CN10_25), INPUT_OUTPUT (M6.10)
PWM_M3: controllers (U1.CN7_17), INPUT_OUTPUT (M7.16)
PWM_M4: controllers (U1.CN7_30), INPUT_OUTPUT (M7.10)
PWM_Servo: controllers (U1.CN10_2), INPUT_OUTPUT (J6.1)
RPi Shutdown: controllers (U2.29), INPUT_OUTPUT (Shutdown_RPi.3 Shutdown_RPi.4)
Rpi_PWM_Fan: controllers (U2.36), INPUT_OUTPUT (*.3)
STM_SCL: controllers (J15.2 R41.1 U1.CN10_3), INPUT_OUTPUT (U3.1 U4.8)
STM_SDA: controllers (J15.1 R40.1 U1.CN7_21), INPUT_OUTPUT (U3.11 U4.9)